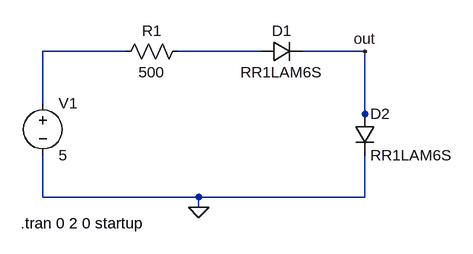
[diagram p0: schematic Draft1.asc]
Draft1.asc, the LTspice schematic file:
Version 4
SHEET 1 880 680
WIRE 96 112 -32 112
WIRE 304 112 176 112
WIRE 464 112 368 112
WIRE -32 192 -32 112
WIRE 464 208 464 112
WIRE 464 224 464 208
WIRE -32 336 -32 272
WIRE 208 336 -32 336
WIRE 464 336 464 272
WIRE 464 336 208 336
WIRE 208 352 208 336
FLAG 208 352 0
FLAG 464 112 out
SYMBOL voltage -32 176 R0
WINDOW 123 0 0 Left 0
WINDOW 39 0 0 Left 0
SYMATTR InstName V1
SYMATTR Value 5
SYMBOL res 192 96 R90
WINDOW 0 0 56 VBottom 2
WINDOW 3 32 56 VTop 2
SYMATTR InstName R1
SYMATTR Value 500
SYMBOL diode 448 208 R0
SYMATTR InstName D2
SYMATTR Value RR1LAM6S
SYMBOL diode 304 128 R270
WINDOW 0 32 32 VTop 2
WINDOW 3 0 32 VBottom 2
SYMATTR InstName D1
SYMATTR Value RR1LAM6S
TEXT -66 376 Left 2 !.tran 0 2 0 startup

The netlist it stands for:
* Draft1.asc
V1 N001 0 5
R1 N002 N001 500
D2 out 0 RR1LAM6S
D1 N002 out RR1LAM6S
.model D D
.lib standard.dio
.tran 0 2 0 startup
.backanno
.end